# Altium project Visiting_card.PrjPcb
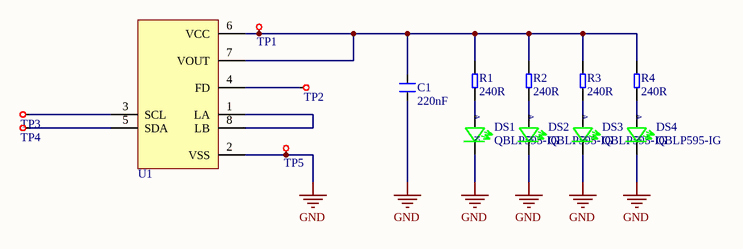
[diagram p0: NFC_Schematics.SchDoc]
1 sheet, 15 parts. Net scope: global (net labels, ports and power ports of the same name join across sheets).
Board file: VC.PcbDoc

## Sheet NFC_Schematics.SchDoc
size A3; SheetNumber: 1; SheetTotal: 1

### Parts
C1  220nF  [CAP_0402]
DS1  QBLP595-IG  [LED_0402]
DS2  QBLP595-IG  [LED_0402]
DS3  QBLP595-IG  [LED_0402]
DS4  QBLP595-IG  [LED_0402]
R1  240R  [RES_0402]
R2  240R  [RES_0402]
R3  240R  [RES_0402]
R4  240R  [RES_0402]
TP1  Test Point SMD Round 0.8mm  [Test Point Round 0.8mm]  (value not drawn)
TP2  Test Point SMD Round 0.8mm  [Test Point Round 0.8mm]  (value not drawn)
TP3  Test Point SMD Round 0.8mm  [Test Point Round 0.8mm]  (value not drawn)
TP4  Test Point SMD Round 0.8mm  [Test Point Round 0.8mm]  (value not drawn)
TP5  Test Point SMD Round 0.8mm  [Test Point Round 0.8mm]  (value not drawn)
U1  NT3H2111_2211  [IC_NT3H2211W0FHKH]  (value not drawn)

### Nets
GND: C1.1 DS1.2 DS2.2 DS3.2 DS4.2 TP5.1 U1.2(VSS)
NetC1_2: C1.2 R1.2 R2.2 R3.2 R4.2 TP1.1 U1.6(VCC) U1.7(VOUT)
NetDS1_1: DS1.1 R1.1
NetDS2_1: DS2.1 R2.1
NetDS3_1: DS3.1 R3.1
NetDS4_1: DS4.1 R4.1
NetTP2_1: TP2.1 U1.4(FD)
NetTP3_1: TP3.1 U1.3(SCL)
NetTP4_1: TP4.1 U1.5(SDA)
NetU1_1: U1.1(LA) U1.8(LB)

### Notes on the sheet
- (in symbol LED_Green_0402_3.1V_QBLP595-IG) A; K

### Library data of the parts
C1 = CAP_220nF-10V-10%-0402: 0.22µF ±10% 10V Ceramic Capacitor X7R 0402 (1005 Metric) /; Manufacturer: Samsung Electro-Mechanics; Manufacturer Part Number: CL05B224KP5NNNC; Case/Package: 0402; Supplier-1: Digikey
DS1-DS4 = LED_Green_0402_3.1V_QBLP595-IG: LED Uni-Color True Green 2-Pin Chip 0402(1006Metric) T/R; Manufacturer: QT-Brightek; Lens Color: Colorless; Lens Style: Flat; Lens Transparency: Clear; Luminous Intensity: 600mcd; Forward Voltage: 3.1V; Test Current: 20mA; Viewing Angle: 140°; Dominant Wavelength: 520nm; Lens Size: 0.5mm; Supplier 1: Digi-Key; Supplier Part Number 1: 1516-1216-1-ND; Manufacturer Part Number: QBLP595-IG; RoHS: Yes; Category: LEDs; Stock 1: 385550; Pricing 1: 1=0.39, 10=0.306, 100=0.1373, 500=0.12402, 1000=0.10187, 2000=0.08858 (USD); Mount: Surface Mount; Case/Package: 0402; Color: Green; Case Code (Imperial): 0402; Case Code (Metric): 1005; Packaging: Cut Tape; Series: QBLP595; Length: 1mm; Width: 0.5mm; Height: 0.6mm; RoHS Compliant: Yes; ComponentLink1URL: http://www.qt-brightek.com/datasheet/QBLP595 Series.pdf?src-supplier=Digi-Key; ComponentLink1Description: http://www.qt-brightek.com/datasheet/QBLP595 Series.pdf?src-supplier=Digi-Key
R1-R4 = RES_240R-0.1W-1%-0402: 240 Ohms ±1% 0.1W, 1/10W Chip Resistor 0402 (1005 Metric) Automotive AEC-Q200 Thick Film /; Manufacturer: Panasonic Electronic Components; Manufacturer Part Number: ERJ-2RKF2400X; Case/Package: 0402; Supplier-1: Digikey
TP1-TP5 = Test Point SMD Round 0.8mm: Testpoint SMD Round
U1 = IC_NFC_: RFID Transponder IC 13.56MHz ISO 14443 I²C 3.6V 8-XFQFN Exposed Pad